# Altium schematic sheet Blackbox_Brightness_Sensor_Schematic.SchDoc
size A4; DocumentNumber: 1; SheetNumber: 1; SheetTotal: 2
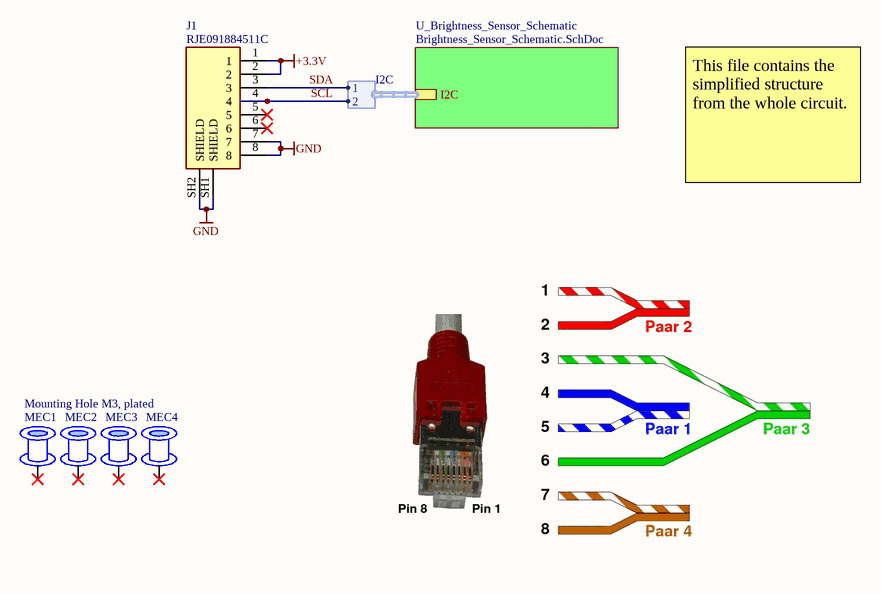
[diagram p0: Blackbox_Brightness_Sensor_Schematic.SchDoc]

## Parts
J1  RJE091884511C  [RJ45]
MEC1  Mounting Hole M3, plated  [Mounting Hole M3, plated]
MEC2  Mounting Hole M3, plated  [Mounting Hole M3, plated]  (value not drawn)
MEC3  Mounting Hole M3, plated  [Mounting Hole M3, plated]  (value not drawn)
MEC4  Mounting Hole M3, plated  [Mounting Hole M3, plated]  (value not drawn)

## Sub-sheets
U_Brightness_Sensor_Schematic = Brightness_Sensor_Schematic.SchDoc: I2C (harness I2C)

## Harnesses
I2C: 1, 2

## Nets
+3.3V: J1.1 J1.2
GND: J1.7 J1.8 J1.SH1(SHIELD) J1.SH2(SHIELD)
SCL: J1.4 ; sheet U_Brightness_Sensor_Schematic/I2C.2
SDA: J1.3 ; sheet U_Brightness_Sensor_Schematic/I2C.1

Not connected (* = marked no-connect by the designer): J1 5* 6*; MEC1 1*; MEC2 1*; MEC3 1*; MEC4 1*

## Notes on the sheet
- This file contains the simplified structure from the whole circuit.
- Date:
- Title of drawing:
- Time:
- Drawn by:
- Project:
- Revision:
- Institut:
- Departement:
- Page:
- from:
- File:

## Library data of the parts
J1 = RJ45: Jack Modular Connector 8p8c (RJ45, Ethernet) 90Â° Angle (Right) Shielded Cat3.; MF: Amphenol ICC (Commercial Products); SnapEDA_Link: https://www.snapeda.com/parts/RJE091884511C/Amphenol/view-part/?ref=snap; Package: None; Value: *; MP: RJE091884511C; Check_prices: https://www.snapeda.com/parts/RJE091884511C/Amphenol/view-part/?ref=eda; System: Connector
MEC1-MEC4 = Mounting Hole M3, plated: Mounting Hole for M3 Screw, plated to connect signal